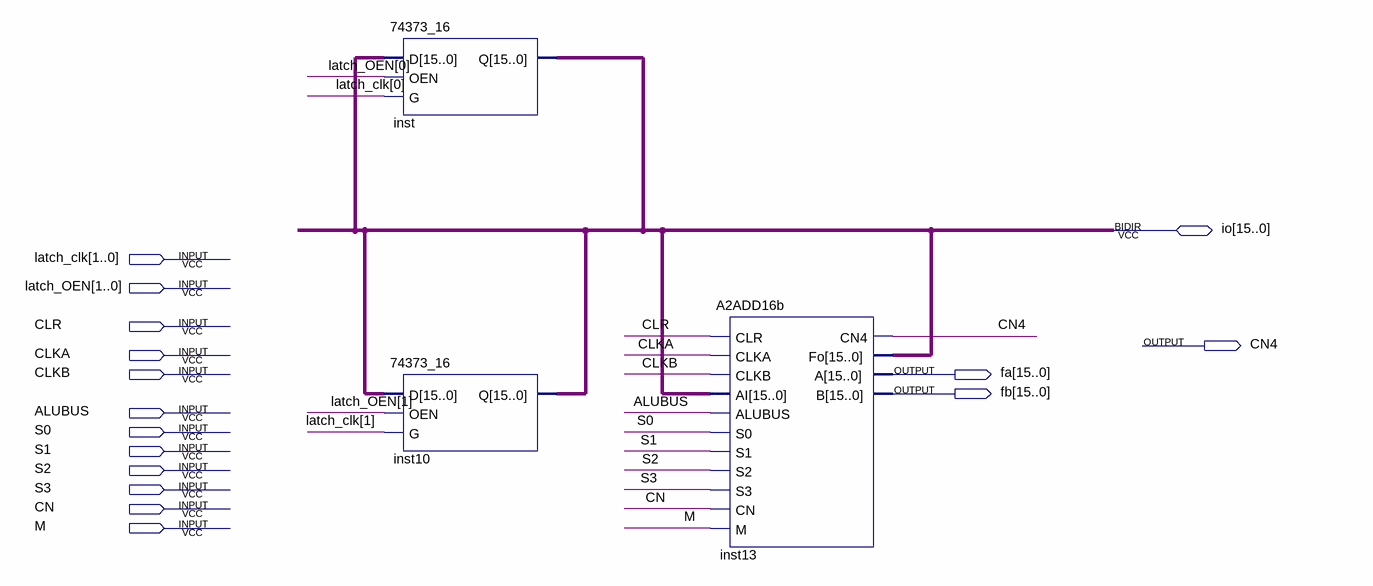
[diagram p0: schematic sheet]
// Quartus schematic A2.bdf as structural Verilog: 3 symbols, 16 pins
module A2 (
  input  [1:0] latch_clk,
  input  [1:0] latch_OEN,
  input  CLR,
  input  CLKA,
  input  CLKB,
  input  ALUBUS,
  input  S0,
  input  S1,
  input  S2,
  input  S3,
  input  CN,
  input  M,
  inout  [15:0] io,
  output CN4,
  output [15:0] fa,
  output [15:0] fb
);

  \74373_16  inst (.D(io), .OEN(latch_OEN[0]), .G(latch_clk[0]), .Q(io));
  \74373_16  inst10 (.D(io), .OEN(latch_OEN[1]), .G(latch_clk[1]), .Q(io));
  A2ADD16b inst13 (
    .CLR(CLR), .CLKA(CLKA), .CLKB(CLKB), .AI(io), .ALUBUS(ALUBUS), .S0(S0), .S1(S1), .S2(S2), .S3(S3),
    .CN(CN), .M(M), .CN4(CN4), .Fo(io), .A(fa), .B(fb));
endmodule
